# EAGLE schematic W123X (EAGLE 6.6.0)
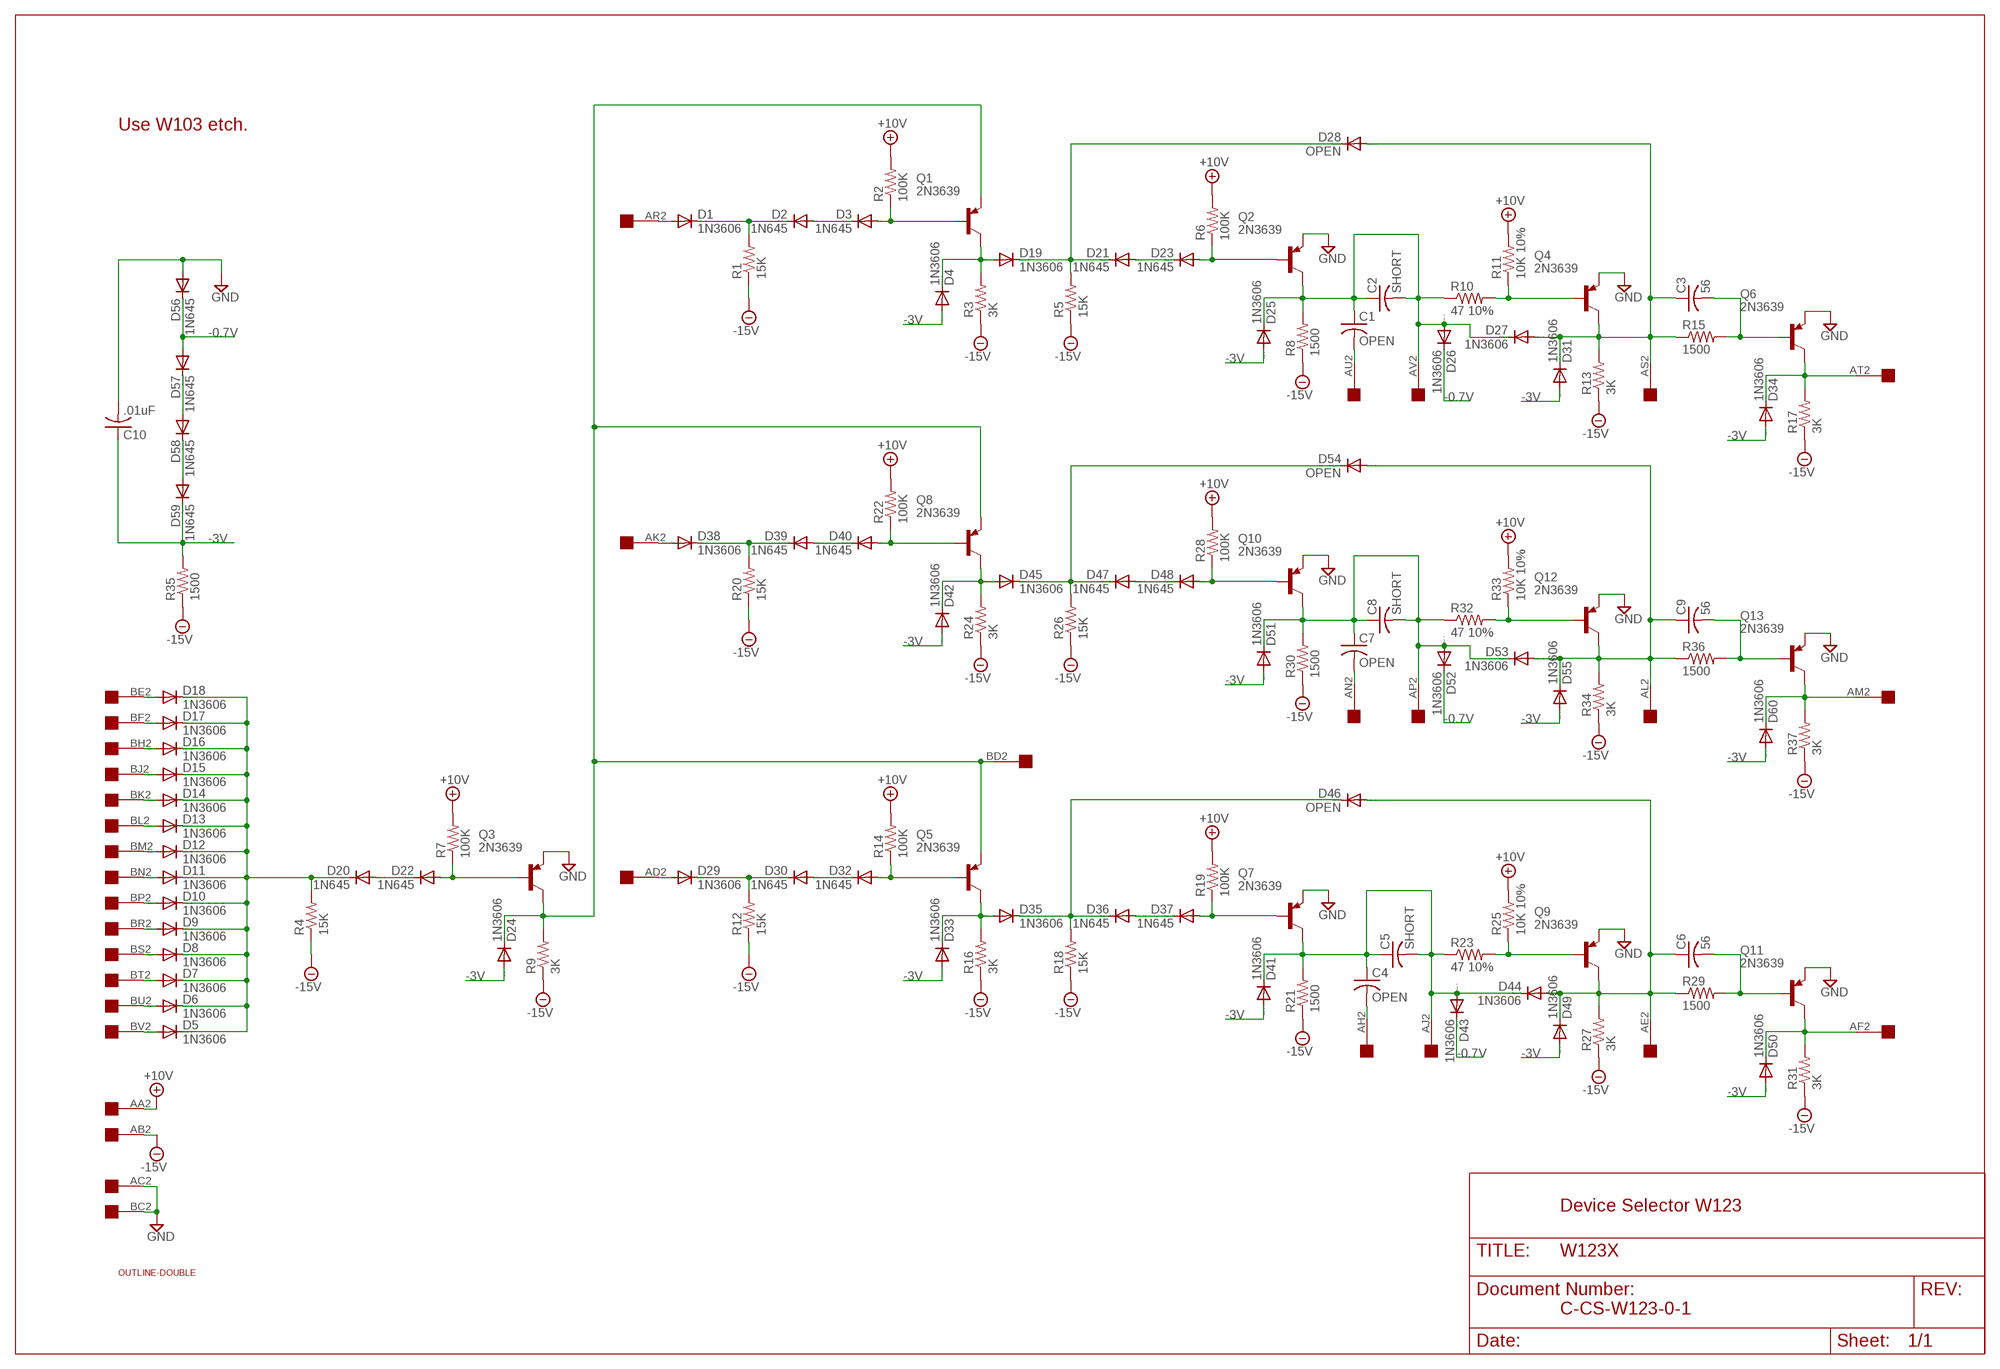
[diagram p0: schematic, sheet 1]

## Parts
C1  OPEN  C-US075-032X103  [C075-032X103]
C2  SHORT  C-US075-032X103  [C075-032X103]
C3  56  C-US075-032X103  [C075-032X103]
C4  OPEN  C-US075-032X103  [C075-032X103]
C5  SHORT  C-US075-032X103  [C075-032X103]
C6  56  C-US075-032X103  [C075-032X103]
C7  OPEN  C-US075-032X103  [C075-032X103]
C8  SHORT  C-US075-032X103  [C075-032X103]
C9  56  C-US075-032X103  [C075-032X103]
C10  .01uF  C-US075-032X103  [C075-032X103]
D1  1N3606  1N4148DO35-10  [DO35-10]
D2  1N645  1N4148DO35-10  [DO35-10]
D3  1N645  1N4148DO35-10  [DO35-10]
D4  1N3606  1N4148DO35-10  [DO35-10]
D5  1N3606  1N4148DO35-10  [DO35-10]
D6  1N3606  1N4148DO35-10  [DO35-10]
D7  1N3606  1N4148DO35-10  [DO35-10]
D8  1N3606  1N4148DO35-10  [DO35-10]
D9  1N3606  1N4148DO35-10  [DO35-10]
D10  1N3606  1N4148DO35-10  [DO35-10]
D11  1N3606  1N4148DO35-10  [DO35-10]
D12  1N3606  1N4148DO35-10  [DO35-10]
D13  1N3606  1N4148DO35-10  [DO35-10]
D14  1N3606  1N4148DO35-10  [DO35-10]
D15  1N3606  1N4148DO35-10  [DO35-10]
D16  1N3606  1N4148DO35-10  [DO35-10]
D17  1N3606  1N4148DO35-10  [DO35-10]
D18  1N3606  1N4148DO35-10  [DO35-10]
D19  1N3606  1N4148DO35-10  [DO35-10]
D20  1N645  1N4148DO35-10  [DO35-10]
D21  1N645  1N4148DO35-10  [DO35-10]
D22  1N645  1N4148DO35-10  [DO35-10]
D23  1N645  1N4148DO35-10  [DO35-10]
D24  1N3606  1N4148DO35-10  [DO35-10]
D25  1N3606  1N4148DO35-10  [DO35-10]
D26  1N3606  1N4148DO35-10  [DO35-10]
D27  1N3606  1N4148DO35-10  [DO35-10]
D28  OPEN  1N4148DO35-10  [DO35-10]
D29  1N3606  1N4148DO35-10  [DO35-10]
D30  1N645  1N4148DO35-10  [DO35-10]
D31  1N3606  1N4148DO35-10  [DO35-10]
D32  1N645  1N4148DO35-10  [DO35-10]
D33  1N3606  1N4148DO35-10  [DO35-10]
D34  1N3606  1N4148DO35-10  [DO35-10]
D35  1N3606  1N4148DO35-10  [DO35-10]
D36  1N645  1N4148DO35-10  [DO35-10]
D37  1N645  1N4148DO35-10  [DO35-10]
D38  1N3606  1N4148DO35-10  [DO35-10]
D39  1N645  1N4148DO35-10  [DO35-10]
D40  1N645  1N4148DO35-10  [DO35-10]
D41  1N3606  1N4148DO35-10  [DO35-10]
D42  1N3606  1N4148DO35-10  [DO35-10]
D43  1N3606  1N4148DO35-10  [DO35-10]
D44  1N3606  1N4148DO35-10  [DO35-10]
D45  1N3606  1N4148DO35-10  [DO35-10]
D46  OPEN  1N4148DO35-10  [DO35-10]
D47  1N645  1N4148DO35-10  [DO35-10]
D48  1N645  1N4148DO35-10  [DO35-10]
D49  1N3606  1N4148DO35-10  [DO35-10]
D50  1N3606  1N4148DO35-10  [DO35-10]
D51  1N3606  1N4148DO35-10  [DO35-10]
D52  1N3606  1N4148DO35-10  [DO35-10]
D53  1N3606  1N4148DO35-10  [DO35-10]
D54  OPEN  1N4148DO35-10  [DO35-10]
D55  1N3606  1N4148DO35-10  [DO35-10]
D56  1N645  1N4148DO35-10  [DO35-10]
D57  1N645  1N4148DO35-10  [DO35-10]
D58  1N645  1N4148DO35-10  [DO35-10]
D59  1N645  1N4148DO35-10  [DO35-10]
D60  1N3606  1N4148DO35-10  [DO35-10]
Q1  2N3639  2N2904  [TO39]
Q2  2N3639  2N2904  [TO39]
Q3  2N3639  2N2904  [TO39]
Q4  2N3639  2N2904  [TO39]
Q5  2N3639  2N2904  [TO39]
Q6  2N3639  2N2904  [TO39]
Q7  2N3639  2N2904  [TO39]
Q8  2N3639  2N2904  [TO39]
Q9  2N3639  2N2904  [TO39]
Q10  2N3639  2N2904  [TO39]
Q11  2N3639  2N2904  [TO39]
Q12  2N3639  2N2904  [TO39]
Q13  2N3639  2N2904  [TO39]
R1  15K  R-US_0207/10  [0207/10]
R2  100K  R-US_0207/10  [0207/10]
R3  3K  R-US_0207/10  [0207/10]
R4  15K  R-US_0207/10  [0207/10]
R5  15K  R-US_0207/10  [0207/10]
R6  100K  R-US_0207/10  [0207/10]
R7  100K  R-US_0207/10  [0207/10]
R8  1500  R-US_0207/10  [0207/10]
R9  3K  R-US_0207/10  [0207/10]
R10  47 10%  R-US_0207/10  [0207/10]
R11  10K 10%  R-US_0207/10  [0207/10]
R12  15K  R-US_0207/10  [0207/10]
R13  3K  R-US_0207/10  [0207/10]
R14  100K  R-US_0207/10  [0207/10]
R15  1500  R-US_0207/10  [0207/10]
R16  3K  R-US_0207/10  [0207/10]
R17  3K  R-US_0207/10  [0207/10]
R18  15K  R-US_0207/10  [0207/10]
R19  100K  R-US_0207/10  [0207/10]
R20  15K  R-US_0207/10  [0207/10]
R21  1500  R-US_0207/10  [0207/10]
R22  100K  R-US_0207/10  [0207/10]
R23  47 10%  R-US_0207/10  [0207/10]
R24  3K  R-US_0207/10  [0207/10]
R25  10K 10%  R-US_0207/10  [0207/10]
R26  15K  R-US_0207/10  [0207/10]
R27  3K  R-US_0207/10  [0207/10]
R28  100K  R-US_0207/10  [0207/10]
R29  1500  R-US_0207/10  [0207/10]
R30  1500  R-US_0207/10  [0207/10]
R31  3K  R-US_0207/10  [0207/10]
R32  47 10%  R-US_0207/10  [0207/10]
R33  10K 10%  R-US_0207/10  [0207/10]
R34  3K  R-US_0207/10  [0207/10]
R35  1500  R-US_0207/10  [0207/10]
R36  1500  R-US_0207/10  [0207/10]
R37  3K  R-US_0207/10  [0207/10]
U$1  OUTLINE-DOUBLE  [DOUBLE]
U$2  DOUBLE  [EDGE-CON4]

## Nets
+10V [Supply]: R2.2 R6.2 R7.2 R11.2 R14.2 R19.2 R22.2 R25.2 R28.2 R33.2 U$2.AA2
-0.7V [Supply]: D26.C D43.C D52.C D56.C D57.A
-3V [Supply]: C10.1 D4.A D24.A D25.A D31.A D33.A D34.A D41.A D42.A D49.A D50.A D51.A D55.A D59.C D60.A R35.2
-15V [Supply]: R1.1 R3.1 R4.1 R5.1 R8.1 R9.1 R12.1 R13.1 R16.1 R17.1 R18.1 R20.1 R21.1 R24.1 R26.1 R27.1 R30.1 R31.1 R34.1 R35.1 R37.1 U$2.AB2
GND [Supply]: C10.2 D56.A Q2.1(E) Q3.1(E) Q4.1(E) Q6.1(E) Q7.1(E) Q9.1(E) Q10.1(E) Q11.1(E) Q12.1(E) Q13.1(E) U$2.AC2 U$2.BC2
N$1: D14.A U$2.BK2
N$2: D15.A U$2.BJ2
N$3: D16.A U$2.BH2
N$4: D17.A U$2.BF2
N$5: D18.A U$2.BE2
N$6: D13.A U$2.BL2
N$7: D5.A U$2.BV2
N$8: D6.A U$2.BU2
N$9: D7.A U$2.BT2
N$10: D8.A U$2.BS2
N$11: D9.A U$2.BR2
N$12: D10.A U$2.BP2
N$13: D11.A U$2.BN2
N$14: D12.A U$2.BM2
N$15: D5.C D6.C D7.C D8.C D9.C D10.C D11.C D12.C D13.C D14.C D15.C D16.C D17.C D18.C D20.C R4.2
N$16: D20.A D22.C
N$17: D22.A Q3.2(B) R7.1
N$18: D24.C Q1.1(E) Q3.3(C) Q5.1(E) Q8.1(E) R9.2 U$2.BD2
N$19: D29.A U$2.AD2
N$20: D29.C D30.C R12.2
N$21: D30.A D32.C
N$22: D32.A Q5.2(B) R14.1
N$23: D33.C D35.A Q5.3(C) R16.2
N$24: D1.A U$2.AR2
N$25: D35.C D36.C D46.C R18.2
N$26: D36.A D37.C
N$27: D37.A Q7.2(B) R19.1
N$28: C4.1 C5.1 C5.2 D41.C D43.A D44.C Q7.3(C) R21.2 R23.1 U$2.AJ2
N$29: C4.2 U$2.AH2
N$31: Q9.2(B) R23.2 R25.1
N$32: C6.1 D44.A D46.A D49.C Q9.3(C) R27.2 R29.1 U$2.AE2
N$33: C6.2 Q11.2(B) R29.2
N$34: D50.C Q11.3(C) R31.2 U$2.AF2
N$35: D1.C D2.C R1.2
N$36: D2.A D3.C
N$37: D3.A Q1.2(B) R2.1
N$38: D4.C D19.A Q1.3(C) R3.2
N$39: D19.C D21.C D28.C R5.2
N$40: D21.A D23.C
N$41: D23.A Q2.2(B) R6.1
N$42: C1.1 C2.1 C2.2 D25.C D26.A D27.C Q2.3(C) R8.2 R10.1 U$2.AV2
N$43: D38.A U$2.AK2
N$44: C1.2 U$2.AU2
N$46: Q4.2(B) R10.2 R11.1
N$47: C3.1 D27.A D28.A D31.C Q4.3(C) R13.2 R15.1 U$2.AS2
N$48: C3.2 Q6.2(B) R15.2
N$49: D34.C Q6.3(C) R17.2 U$2.AT2
N$50: D38.C D39.C R20.2
N$51: D39.A D40.C
N$52: D40.A Q8.2(B) R22.1
N$53: D42.C D45.A Q8.3(C) R24.2
N$54: D45.C D47.C D54.C R26.2
N$55: D47.A D48.C
N$56: D48.A Q10.2(B) R28.1
N$57: C7.1 C8.1 C8.2 D51.C D52.A D53.C Q10.3(C) R30.2 R32.1 U$2.AP2
N$58: C7.2 U$2.AN2
N$60: Q12.2(B) R32.2 R33.1
N$61: C9.1 D53.A D54.A D55.C Q12.3(C) R34.2 R36.1 U$2.AL2
N$62: C9.2 Q13.2(B) R36.2
N$63: D60.C Q13.3(C) R37.2 U$2.AM2
N$65 [Supply]: D58.C D59.A
N$66 [Supply]: D57.C D58.A
Unconnected: U$2.AA1 U$2.AB1 U$2.AC1 U$2.AD1 U$2.AE1 U$2.AF1 U$2.AH1 U$2.AJ1 U$2.AK1 U$2.AL1 U$2.AM1 U$2.AN1 U$2.AP1 U$2.AR1 U$2.AS1 U$2.AT1 U$2.AU1 U$2.AV1 U$2.BA1 U$2.BA2 U$2.BB1 U$2.BB2 U$2.BC1 U$2.BD1 U$2.BE1 U$2.BF1 U$2.BH1 U$2.BJ1 U$2.BK1 U$2.BL1 U$2.BM1 U$2.BN1 U$2.BP1 U$2.BR1 U$2.BS1 U$2.BT1 U$2.BU1 U$2.BV1

## Notes on the sheet
- Use W103 etch.
- Device Selector W123
- C-CS-W123-0-1

## Library data of the parts
C1-C10 = rcl:C-US: CAPACITOR, American symbol
D1-D60 = diode:1N4148: DIODE high speed (Philips)
Q1-Q13 = transistor-pnp:2N2904*: PNP Transistror
R1-R37 = rcl:R-US_: RESISTOR, American symbol
U$1 = dec-con:OUTLINE-*: Board outlines for DEC boards.
U$2 = dec-con:DOUBLE: Double-Height DEC board

## Net classes
1 Supply: width 0.813 mm